# EAGLE schematic DAC_12bitController (EAGLE 7.2.0)
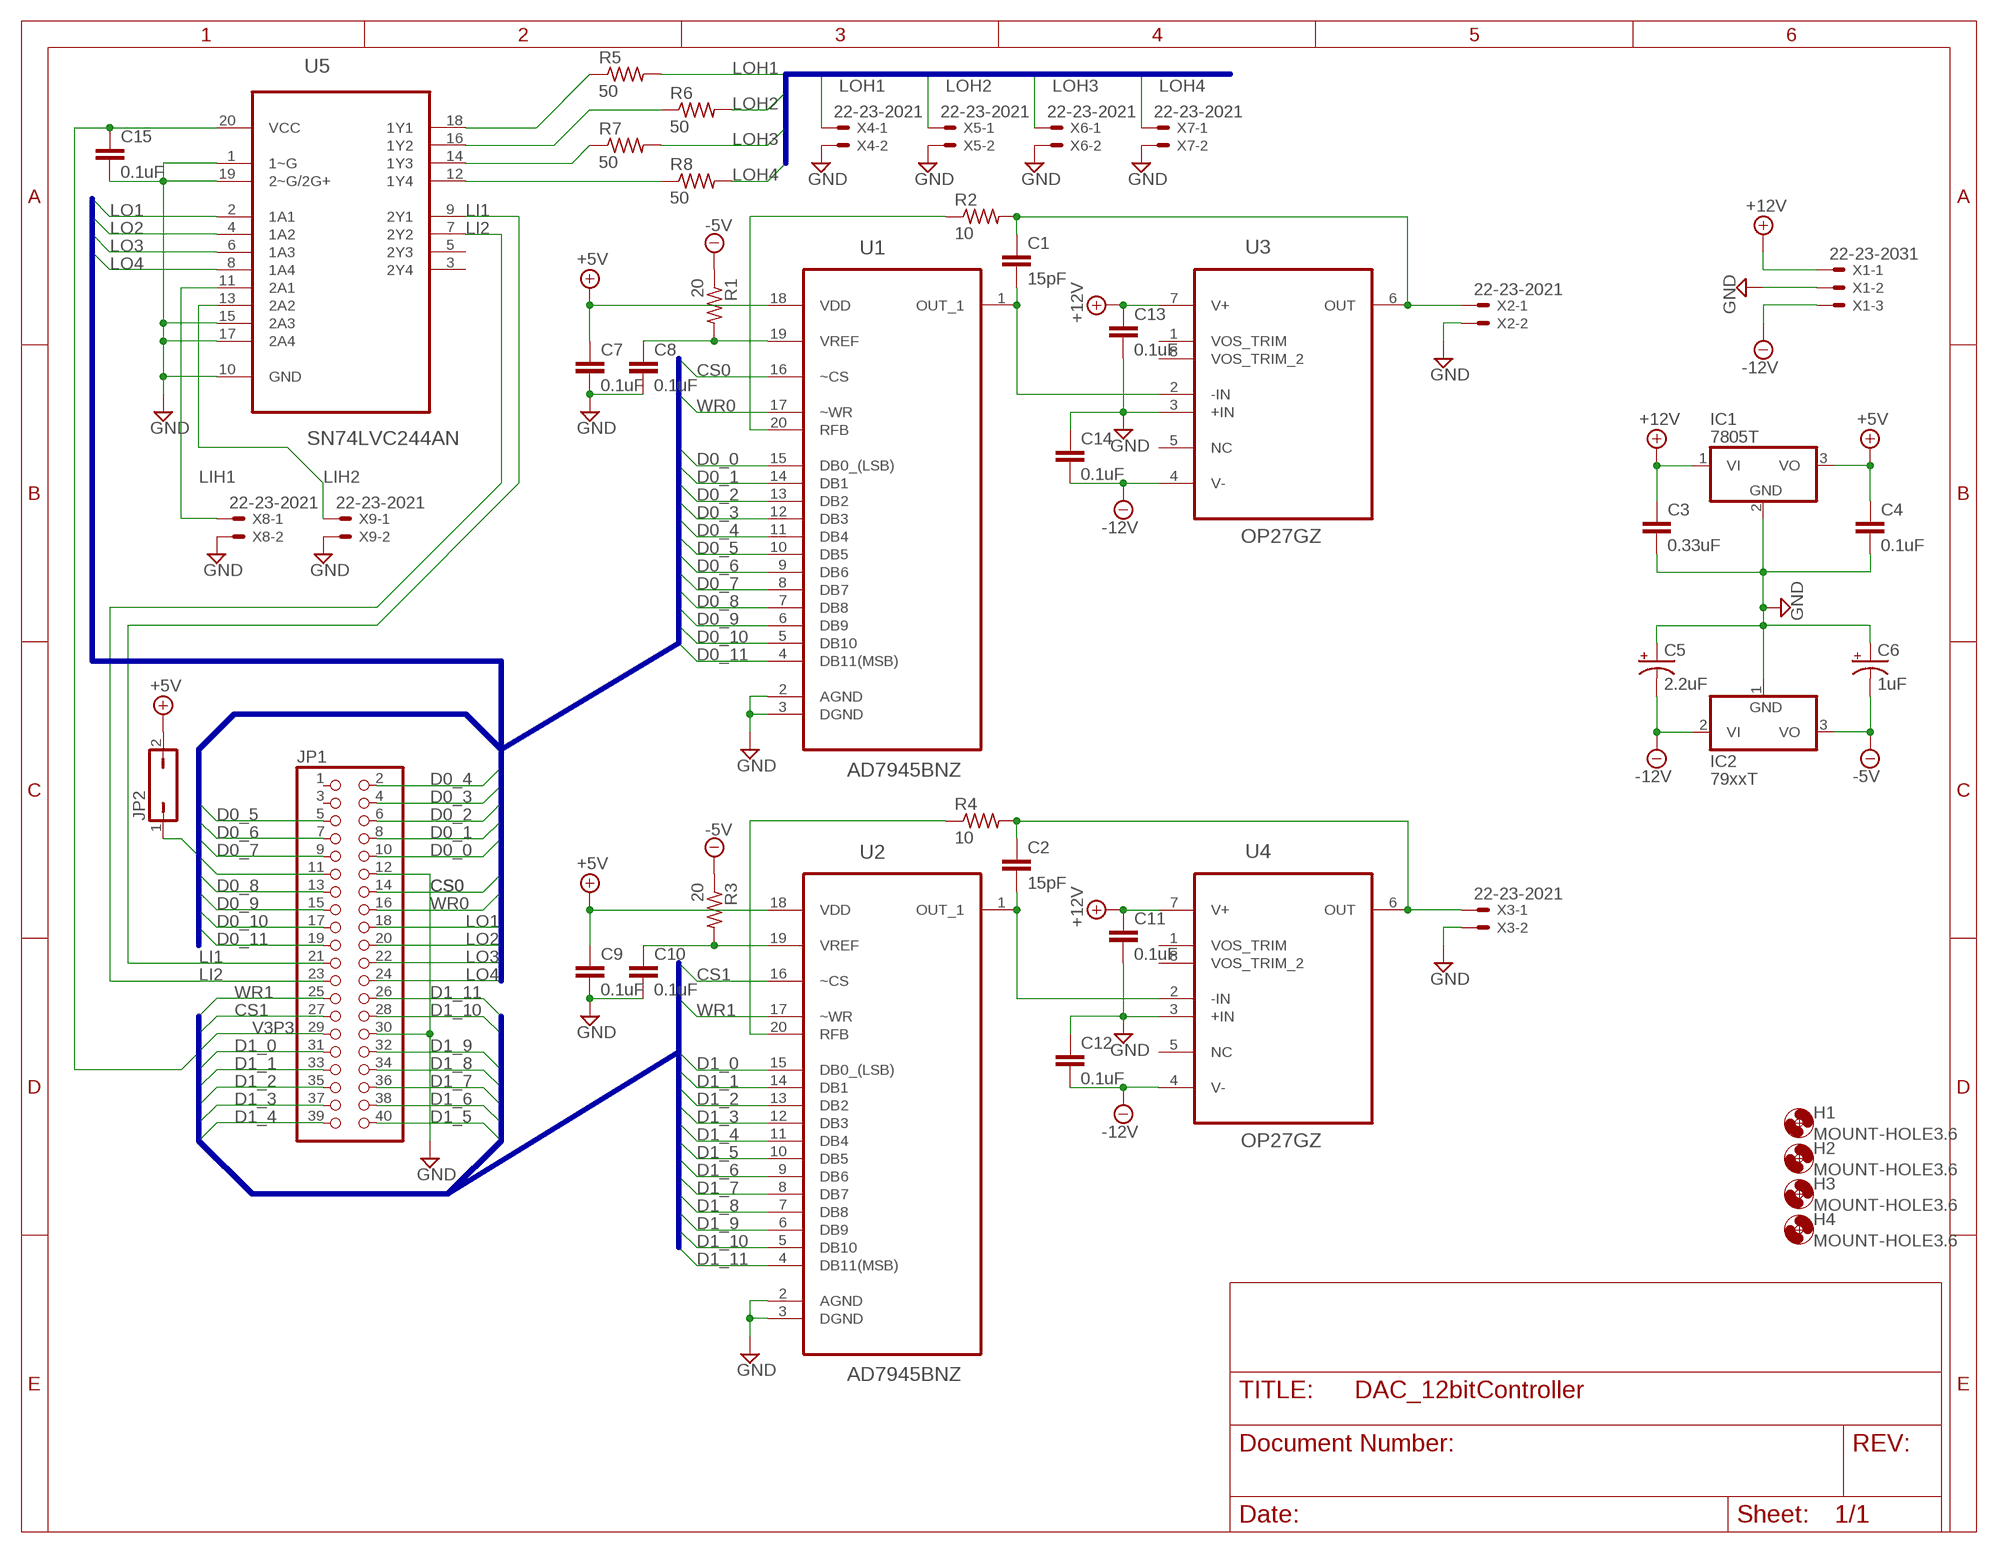
[diagram p0: schematic, sheet 1]

## Parts
C1  15pF  C5/2.5  [C5B2.5]
C2  15pF  C5/2.5  [C5B2.5]
C3  0.33uF  C5/2.5  [C5B2.5]
C4  0.1uF  C5/2.5  [C5B2.5]
C5  2.2uF  CPOL-USE2.5-7  [E2,5-7]
C6  1uF  CPOL-USE2.5-7  [E2,5-7]
C7  0.1uF  C5/2.5  [C5B2.5]
C8  0.1uF  C5/2.5  [C5B2.5]
C9  0.1uF  C5/2.5  [C5B2.5]
C10  0.1uF  C5/2.5  [C5B2.5]
C11  0.1uF  C5/2.5  [C5B2.5]
C12  0.1uF  C5/2.5  [C5B2.5]
C13  0.1uF  C5/2.5  [C5B2.5]
C14  0.1uF  C5/2.5  [C5B2.5]
C15  0.1uF  C5/2.5  [C5B2.5]
H1  MOUNT-HOLE3.6  [3,6]
H2  MOUNT-HOLE3.6  [3,6]
H3  MOUNT-HOLE3.6  [3,6]
H4  MOUNT-HOLE3.6  [3,6]
IC1  7805T  [TO220H]
IC2  79xxT  7905T  [TO220H]
JP1  PINHD-2X20  [2X20]
JP2  JP1Q  [JP1]
R1  20  R-US_0207/10  [0207/10]
R2  10  R-US_0207/10  [0207/10]
R3  20  R-US_0207/10  [0207/10]
R4  10  R-US_0207/10  [0207/10]
R5  50  R-US_0207/10  [0207/10]
R6  50  R-US_0207/10  [0207/10]
R7  50  R-US_0207/10  [0207/10]
R8  50  R-US_0207/10  [0207/10]
U1  AD7945BNZ  AD7545AKNZ  [DIP254P762X368-20]
U2  AD7945BNZ  AD7545AKNZ  [DIP254P762X368-20]
U3  OP27GZ  [DIP254P762X508-8]
U4  OP27GZ  [DIP254P762X508-8]
U5  SN74LVC244AN  SN74LS244N  [DIP254P762X508-20]
X1  22-23-2031  [22-23-2031]
X2  22-23-2021  [22-23-2021]
X3  22-23-2021  [22-23-2021]
X4  22-23-2021  [22-23-2021]
X5  22-23-2021  [22-23-2021]
X6  22-23-2021  [22-23-2021]
X7  22-23-2021  [22-23-2021]
X8  22-23-2021  [22-23-2021]
X9  22-23-2021  [22-23-2021]

## Nets
+5V: C4.1 C7.1 C9.1 IC1.3(VO) JP2.2 U1.18(VDD) U2.18(VDD)
+12V: C3.1 C11.1 C13.1 IC1.1(VI) U3.7(V+) U4.7(V+) X1.1
-5V: C6.- IC2.3(VO) R1.1 R3.1
-12V: C5.- C12.2 C14.2 IC2.2(VI) U3.4(V-) U4.4(V-) X1.3
CS0: JP1.14 U1.16(~CS)
CS1: JP1.27 U2.16(~CS)
D0_0: JP1.10 U1.15(DB0_(LSB))
D0_1: JP1.8 U1.14(DB1)
D0_2: JP1.6 U1.13(DB2)
D0_3: JP1.4 U1.12(DB3)
D0_4: JP1.2 U1.11(DB4)
D0_5: JP1.5 U1.10(DB5)
D0_6: JP1.7 U1.9(DB6)
D0_7: JP1.9 U1.8(DB7)
D0_8: JP1.13 U1.7(DB8)
D0_9: JP1.15 U1.6(DB9)
D0_10: JP1.17 U1.5(DB10)
D0_11: JP1.19 U1.4(DB11(MSB))
D1_0: JP1.31 U2.15(DB0_(LSB))
D1_1: JP1.33 U2.14(DB1)
D1_2: JP1.35 U2.13(DB2)
D1_3: JP1.37 U2.12(DB3)
D1_4: JP1.39 U2.11(DB4)
D1_5: JP1.40 U2.10(DB5)
D1_6: JP1.38 U2.9(DB6)
D1_7: JP1.36 U2.8(DB7)
D1_8: JP1.34 U2.7(DB8)
D1_9: JP1.32 U2.6(DB9)
D1_10: JP1.28 U2.5(DB10)
D1_11: JP1.26 U2.4(DB11(MSB))
GND: C3.2 C4.2 C5.+ C6.+ C7.2 C8.2 C9.2 C10.2 C11.2 C12.1 C13.2 C14.1 C15.2 IC1.2(GND) IC2.1(GND) JP1.12 JP1.30 U1.2(AGND) U1.3(DGND) U2.2(AGND) U2.3(DGND) U3.3(+IN) U4.3(+IN) U5.1(1~G) U5.10(GND) U5.15(2A3) U5.17(2A4) U5.19(2~G/2G+) X1.2 X2.2 X3.2 X4.2 X5.2 X6.2 X7.2 X8.2 X9.2
LI1: JP1.21 U5.9(2Y1)
LI2: JP1.23 U5.7(2Y2)
LIH1: U5.11(2A1) X8.1
LIH2: U5.13(2A2) X9.1
LO1: JP1.18 U5.2(1A1)
LO2: JP1.20 U5.4(1A2)
LO3: JP1.22 U5.6(1A3)
LO4: JP1.24 U5.8(1A4)
LOH1: R5.2 X4.1
LOH2: R6.2 X5.1
LOH3: R7.2 X6.1
LOH4: R8.2 X7.1
N$1: JP1.11 JP2.1
N$2: C8.1 R1.2 U1.19(VREF)
N$3: C1.1 R2.2 U3.6(OUT) X2.1
N$5: R5.1 U5.18(1Y1)
N$6: R6.1 U5.16(1Y2)
N$7: R7.1 U5.14(1Y3)
N$8: R8.1 U5.12(1Y4)
N$19: R2.1 U1.20(RFB)
N$21: C10.1 R3.2 U2.19(VREF)
N$22: C2.1 R4.2 U4.6(OUT) X3.1
N$23: R4.1 U2.20(RFB)
OUT0: C1.2 U1.1(OUT_1) U3.2(-IN)
OUT1: C2.2 U2.1(OUT_1) U4.2(-IN)
V3P3: C15.1 JP1.29 U5.20(VCC)
WR0: JP1.16 U1.17(~WR)
WR1: JP1.25 U2.17(~WR)
Unconnected: JP1.1 JP1.3 U3.1(VOS_TRIM) U3.5(NC) U3.8(VOS_TRIM_2) U4.1(VOS_TRIM) U4.5(NC) U4.8(VOS_TRIM_2) U5.3(2Y4) U5.5(2Y3)

## Buses
GND,D0_0,D0_1,D0_2,D0_3,D0_4,D0_5,D0_6,D0_7,D0_8,D0_9,D0_10,D0_11,CS0,WR0
GND,D1_0,D1_1,D1_2,D1_3,D1_4,D1_5,D1_6,D1_7,D1_8,D1_9,D1_10,D1_11,CS1,WR1
LO1,LO2,LO3,LO4
LOH1,LOH2,LOH3,LOH4

## Library data of the parts
C1-C4 C7-C15 = capacitor-wima:C: CAPACITOR naming: grid - package width
C5 C6 = rcl:CPOL-US: POLARIZED CAPACITOR, American symbol
H1-H4 = holes:MOUNT-HOLE: MOUNTING HOLE with drill center marker
IC1 = linear:78*: Positive VOLTAGE REGULATOR Source: http://cache.national.com/ds/LM/LM78L05.pdf http://www.fairchildsemi.com/ds/LM/LM7805.pdf
IC2 = linear:79*: Negative VOLTAGE REGULATOR
JP1 = pinhead:PINHD-2X20: PIN HEADER
JP2 = jumper:JP1Q: JUMPER
R1-R8 = resistor:R-US_: RESISTOR, American symbol
U1 U2 = Analog Devices_By_element14_Batch_1:AD7545AKNZ: Buffered Multiplying DAC; MPN: AD7545AKNZ; OC_FARNELL: 9604553; OC_NEWARK: 59K5021; PACKAGE: DIP-20; SUPPLIER: ANALOG DEVICES
U3 U4 = Analog Devices_By_element14_Batch_1:OP27GZ: Operational Amplifier; MPN: OP27GZ; OC_FARNELL: -; OC_NEWARK: 05F8616; PACKAGE: 8-DIP; SUPPLIER: Analog Devices
U5 = Texas Instruments_By_element14_Batch_1:SN74LS244N: OCTAL BUFFERS AND LINE DRIVERS; MPN: SN74LS244N; OC_FARNELL: 1739688; OC_NEWARK: 60K6872; PACKAGE: PDIP-20; SUPPLIER: Texas Instruments
X1 = con-molex:22-23-2031: .100" (2.54mm) Center Header - 3 Pin; MF: MOLEX; MPN: 22-23-2031; OC_FARNELL: 1462950; OC_NEWARK: 30C0862
X2-X9 = con-molex:22-23-2021: .100" (2.54mm) Center Header - 2 Pin; MF: MOLEX; MPN: 22-23-2021; OC_FARNELL: 1462926; OC_NEWARK: 25C3832